# Altium schematic sheet ESP8266.SchDoc
size A3; SheetNumber: 2; SheetTotal: 5
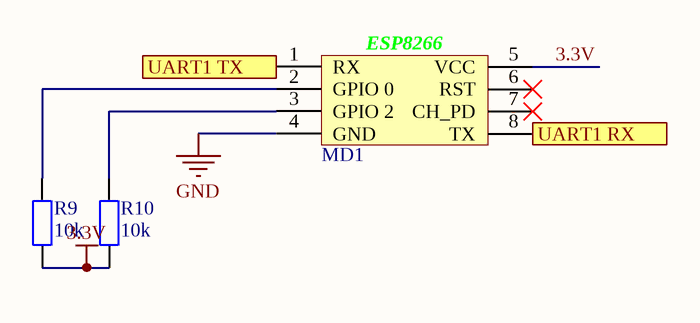
[diagram p0: ESP8266.SchDoc]

## Parts
MD1  ESP8266 Module  [ESP2866 Module]  (value not drawn)
R9  10k  [tro smd 0805]
R10  10k  [tro smd 0805]

## Ports
UART1 RX, UART1 TX

## Nets
3.3V: MD1.5(VCC) R9.1 R10.1
GND: MD1.4(GND)
UART1 RX: MD1.8(TX) ; port UART1 RX
UART1 TX: MD1.1(RX) ; port UART1 TX
NetMD1_2: MD1.2(GPIO_0) R9.2
NetMD1_3: MD1.3(GPIO_2) R10.2

Not connected (* = marked no-connect by the designer): MD1 6(RST)* 7(CH_PD)*

## Notes on the sheet
- (in symbol ESP8266 Module) ESP8266

## Library data of the parts
R9 R10 = Tro 0805 5% 10k: Dán; Don_Vi: Con; So_Chan: 2; Ten_Linh_Kien: Trở 0805 5% 10k; Ma_Hang: MH005239; Chung_Loai: Dán; Kieu_Chan: *